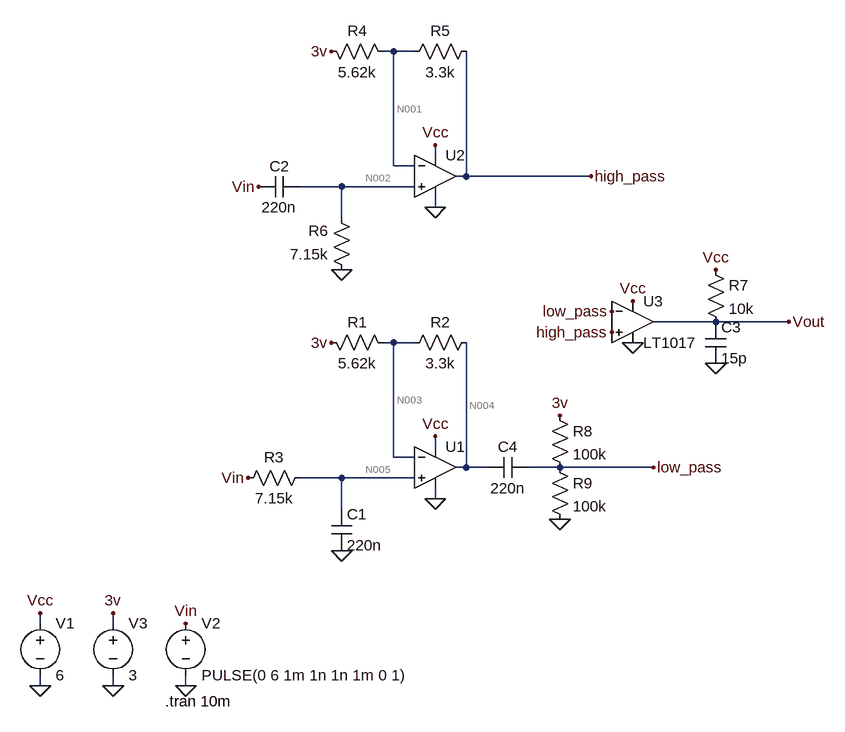
[diagram p0: schematic lowpass.asc]
lowpass.asc, the LTspice schematic file:
Version 4
SHEET 1 888 680
WIRE 208 -480 192 -480
WIRE 240 -480 208 -480
WIRE 272 -320 272 -336
WIRE 208 -304 208 -480
WIRE 240 -304 208 -304
WIRE 320 -288 320 -480
WIRE 320 -288 304 -288
WIRE 512 -288 320 -288
WIRE 128 -272 64 -272
WIRE 240 -272 128 -272
WIRE 272 -240 272 -256
WIRE 128 -224 128 -272
WIRE 704 -64 608 -64
WIRE 816 -64 704 -64
WIRE 208 -32 192 -32
WIRE 240 -32 208 -32
WIRE 272 128 272 112
WIRE 208 144 208 -32
WIRE 240 144 208 144
WIRE 320 160 320 -32
WIRE 320 160 304 160
WIRE 352 160 320 160
WIRE 464 160 416 160
WIRE 608 160 464 160
WIRE 128 176 64 176
WIRE 240 176 128 176
WIRE 272 208 272 192
WIRE 128 224 128 176
WIRE -336 400 -336 384
WIRE -224 400 -224 384
WIRE -336 496 -336 480
WIRE -224 496 -224 480
WIRE -112 496 -112 480
FLAG 272 208 0
FLAG -336 496 0
FLAG -336 384 Vcc
FLAG 272 112 Vcc
FLAG -16 176 Vin
FLAG 608 160 low_pass
FLAG -112 496 0
FLAG 128 288 0
FLAG -112 400 Vin
FLAG -224 496 0
FLAG -224 384 3v
FLAG 112 -32 3v
FLAG 272 -240 0
FLAG 272 -336 Vcc
FLAG 0 -272 Vin
FLAG 512 -288 high_pass
FLAG 128 -144 0
FLAG 112 -480 3v
FLAG 544 -48 high_pass
FLAG 544 -80 low_pass
FLAG 816 -64 Vout
FLAG 576 -96 Vcc
FLAG 576 -32 0
FLAG 704 0 0
FLAG 704 -144 Vcc
FLAG 464 80 3v
FLAG 464 240 0
SYMBOL res 208 -16 M270
WINDOW 0 32 56 VTop 2
WINDOW 3 0 56 VBottom 2
SYMATTR InstName R1
SYMATTR Value 5.62k
SYMBOL res 336 -48 R90
WINDOW 0 0 56 VBottom 2
WINDOW 3 32 56 VTop 2
SYMATTR InstName R2
SYMATTR Value 3.3k
SYMBOL res 80 160 R90
WINDOW 0 0 56 VBottom 2
WINDOW 3 32 56 VTop 2
SYMATTR InstName R3
SYMATTR Value 7.15k
SYMBOL cap 112 224 R0
SYMATTR InstName C1
SYMATTR Value 220n
SYMBOL voltage -336 384 R0
WINDOW 123 0 0 Left 2
WINDOW 39 0 0 Left 2
SYMATTR InstName V1
SYMATTR Value 6
SYMBOL voltage -112 384 R0
WINDOW 123 0 0 Left 2
WINDOW 39 0 0 Left 2
SYMATTR InstName V2
SYMATTR Value PULSE(0 6 1m 1n 1n 1m 0 1)
SYMBOL Opamps\\UniversalOpamp2 272 160 R0
SYMATTR InstName U1
SYMATTR SpiceLine ilimit=25m rail=20m Vos=0 phimargin=45
SYMBOL voltage -224 384 R0
WINDOW 123 0 0 Left 2
WINDOW 39 0 0 Left 2
SYMATTR InstName V3
SYMATTR Value 3
SYMBOL res 208 -464 M270
WINDOW 0 32 56 VTop 2
WINDOW 3 0 56 VBottom 2
SYMATTR InstName R4
SYMATTR Value 5.62k
SYMBOL res 336 -496 R90
WINDOW 0 0 56 VBottom 2
WINDOW 3 32 56 VTop 2
SYMATTR InstName R5
SYMATTR Value 3.3k
SYMBOL res 144 -128 R180
WINDOW 0 36 76 Left 2
WINDOW 3 36 40 Left 2
SYMATTR InstName R6
SYMATTR Value 7.15k
SYMBOL cap 64 -288 R90
WINDOW 0 0 32 VBottom 2
WINDOW 3 32 32 VTop 2
SYMATTR InstName C2
SYMATTR Value 220n
SYMBOL Opamps\\UniversalOpamp2 272 -288 R0
SYMATTR InstName U2
SYMATTR SpiceLine ilimit=25m rail=20m Vos=0 phimargin=45
SYMBOL Comparators\\LT1017 576 -64 R0
SYMATTR InstName U3
SYMBOL res 688 -160 R0
SYMATTR InstName R7
SYMATTR Value 10k
SYMBOL cap 688 -64 R0
SYMATTR InstName C3
SYMATTR Value 15p
SYMBOL res 448 64 R0
SYMATTR InstName R8
SYMATTR Value 100k
SYMBOL res 448 144 R0
SYMATTR InstName R9
SYMATTR Value 100k
SYMBOL cap 416 144 R90
WINDOW 0 0 32 VBottom 2
WINDOW 3 32 32 VTop 2
SYMATTR InstName C4
SYMATTR Value 220n
TEXT -144 520 Left 2 !.tran 10m

The netlist it stands for:
* lowpass.asc
R1 N003 3v 5.62k
R2 N004 N003 3.3k
R3 N005 Vin 7.15k
C1 N005 0 220n
V1 Vcc 0 6
V2 Vin 0 PULSE(0 6 1m 1n 1n 1m 0 1)
XU1 N005 N003 Vcc 0 N004 level.2 Avol=1Meg GBW=10Meg Slew=10Meg ilimit=25m rail=20m Vos=0 phimargin=45 en=0 enk=0 in=0 ink=0 Rin=500Meg  ; pins IN+ IN- V+ V- OUT
V3 3v 0 3
R4 N001 3v 5.62k
R5 high_pass N001 3.3k
R6 0 N002 7.15k
C2 N002 Vin 220n
XU2 N002 N001 Vcc 0 high_pass level.2 Avol=1Meg GBW=10Meg Slew=10Meg ilimit=25m rail=20m Vos=0 phimargin=45 en=0 enk=0 in=0 ink=0 Rin=500Meg  ; pins IN+ IN- V+ V- OUT
XU3 high_pass low_pass Vcc 0 Vout LT1017  ; pins In+ In- V+ V- OUT
R7 Vcc Vout 10k
C3 Vout 0 15p
R8 3v low_pass 100k
R9 low_pass 0 100k
C4 low_pass N004 220n
.tran 10m
.lib UniversalOpamps2.sub
.backanno
.end

* Results of the author's LTspice run, read from the files saved beside the schematic
* Operating Point, zero values left out:
*   V(n003) = 1.125 V
*   V(3v) = 3 V
*   V(n004) = 24.65 mV
*   V(n005) = 42.9 µV
*   V(vcc) = 6 V
*   V(n001) = 1.125 V
*   V(high_pass) = 24.65 mV
*   V(n002) = 42.9 µV
*   V(vout) = 53.08 mV
*   V(low_pass) = 1.5 V
*   I(R9) = 15 µA
*   I(R8) = 15 µA
*   I(R7) = 594.7 µA
*   I(R6) = -6 nA
*   I(R5) = -333.6 µA
*   I(R4) = -333.6 µA
*   I(R3) = 6 nA
*   I(R2) = -333.6 µA
*   I(R1) = -333.6 µA
*   I(V3) = -682.1 µA
*   I(V2) = 6 nA
*   I(V1) = -712.8 µA
*   Ix(u1:1) = -6 nA
*   Ix(u1:2) = -3.749 nA
*   Ix(u1:3) = 715.8 nA
*   Ix(u1:4) = -334.2 µA
*   Ix(u1:5) = 333.6 µA
*   Ix(u2:1) = -6 nA
*   Ix(u2:2) = -3.749 nA
*   Ix(u2:3) = 715.8 nA
*   Ix(u2:4) = -334.2 µA
*   Ix(u2:5) = 333.6 µA
*   Ix(u3:1) = -2.999 nA
*   Ix(u3:2) = 6.103 nA
*   Ix(u3:3) = 116.7 µA
*   Ix(u3:4) = -711.4 µA
*   Ix(u3:5) = 594.7 µA
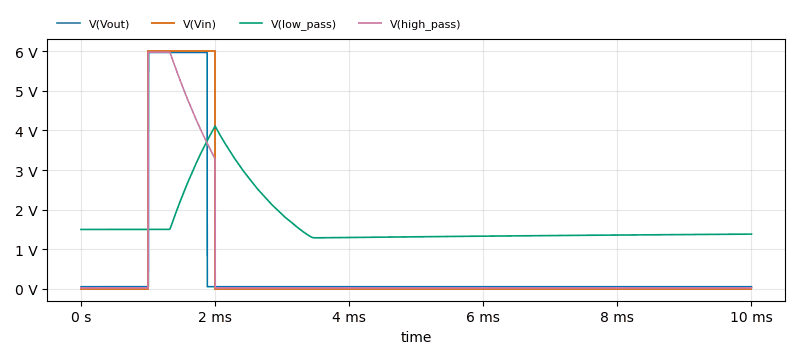
[diagram p1: Transient Analysis of lowpass.asc, plotted from the saved traces]
* Transient Analysis, 1 run:
*   V(Vout): min 53.08 mV, max 5.97 V, average 571.4 mV, rms 1.767 V, last 53.08 mV
*   V(Vin): min 0 V, max 6 V, average 600 mV, rms 1.897 V, last 0 V
*   V(low_pass): min 1.289 V, max 4.107 V, average 1.629 V, rms 1.749 V, last 1.382 V
*   V(high_pass): min 24.65 mV, max 5.975 V, average 522.3 mV, rms 1.609 V, last 24.65 mV